# EAGLE schematic board2 (EAGLE 7.7.0)
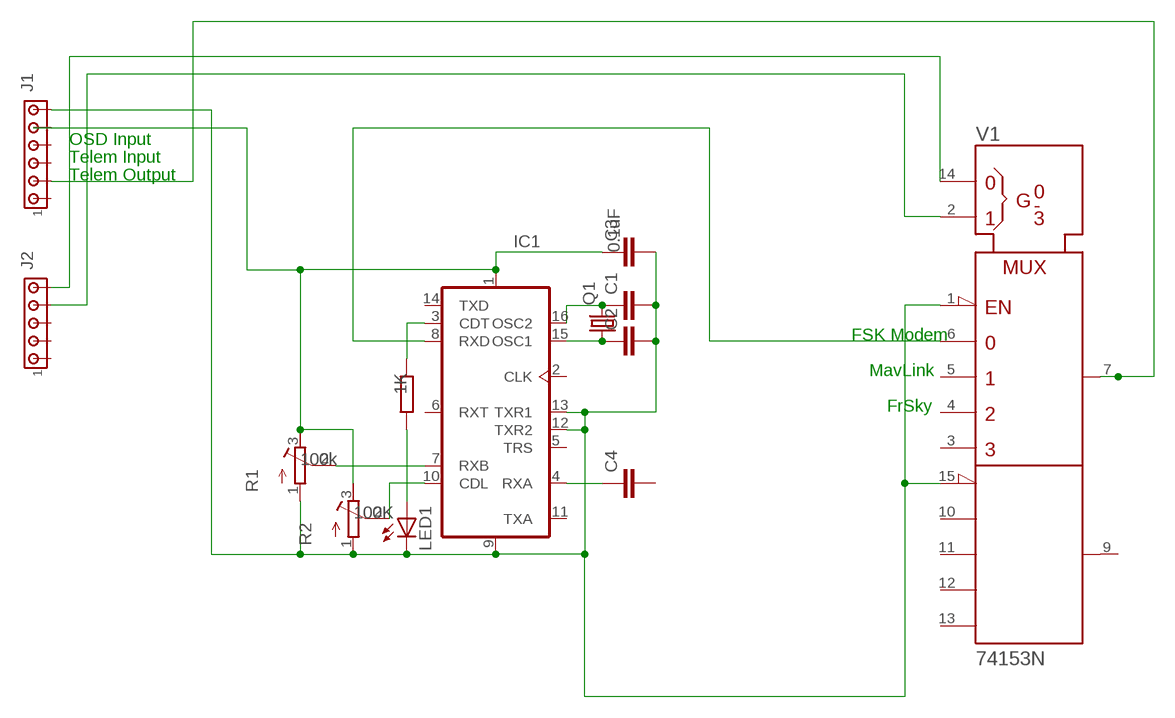
[diagram p0: schematic, sheet 1]
R3 (R): VAL: 1K

## Parts
C1  C2,5-3  [C2.5-3]
C2  C2,5-3  [C2.5-3]
C3  C2,5-3  [C2.5-3]
C4  C2,5-3  [C2.5-3]
IC1  TCM3105  [DIL16]
J1  MTA06-100  [10X06MTA]
J2  MTA05-156  [1X5MTA]
LED1  LED5MM  [LED5MM]
Q1  CRYSTALHC33U-V  [HC33U-V]
R1  R-TRIMM64W  [RTRIM64W]
R2  R-TRIMM64W  [RTRIM64W]
V1  74153N  [DIL16]

## Nets
N$1: C1.1 IC1.16(OSC2) Q1.2
N$2: C2.1 IC1.15(OSC1) Q1.1
N$3: IC1.10(CDL) R2.2(S)
N$4: IC1.3(CDT)
N$5: LED1.A
N$6: J1.2 V1.7(1Y)
N$7: IC1.7(RXB) R1.2(S)
N$9: C3.1 IC1.1(VDD) J1.5 R1.3(E) R2.3(E)
N$11: C4.1 IC1.4(RXA)
N$12: IC1.8(RXD) V1.6(1C0)
N$13: J2.5 V1.14(A)
N$14: J2.4 V1.2(B)
VSS: C1.2 C2.2 C3.2 IC1.9(VSS) IC1.12(TXR2) IC1.13(TXR1) J1.6 LED1.K(C) R1.1(A) R2.1(A) V1.1(!1G) V1.15(!2G)
Unconnected: C4.2 IC1.2(CLK) IC1.5(TRS) IC1.6(RXT) IC1.11(TXA) IC1.14(TXD) J1.1 J1.3 J1.4 J2.1 J2.2 J2.3 V1.3(1C3) V1.4(1C2) V1.5(1C1) V1.9(2Y) V1.10(2C0) V1.11(2C1) V1.12(2C2) V1.13(2C3)

## Notes on the sheet
- OSD Input
- Telem Input
- Telem Output
- FSK Modem
- MavLink
- FrSky

## Power pins joined to a net without a drawn wire
+UB: V1.16(+UB)
-UB: V1.8(-UB)

## Library data of the parts
C1 C2 C4 = capacitor-wima:C: CAPACITOR naming: grid - package width
C3 = capacitor-wima:C: CAPACITOR naming: grid - package width; VAL: 0.1uF
IC1 = tcm3105:TCM3105
J1 = con-amp:MTA06-100: AMP connector Connection corrected 2014-09-19
J2 = con-amp:MTA05-156: AMP connector
LED1 = led:LED: LED OSRAM: - CHIPLED LG R971, LG N971, LY N971, LG Q971, LY Q971, LO R971, LY R971 LH N974, LH R974 LS Q976, LO Q976, LY Q976 LO Q996 - Hyper CHIPLED LW Q18S LB Q993, LB Q99A, LB R99A - SideLED LS A670, LO A670, LY A670, LG A670, LP A670 LB A673, LV A673, LT A673, LW A673 LH A674 LY A675 LS A676, LA A676, LO A676, LY A676, LW A676 LS A679, LY A679, LG A679 - Hyper Micro SIDELED® LS Y876, LA Y876, LO Y876, LY Y876 LT Y87S - SmartLED LW L88C, LW L88S LB L89C, LB L89S, LG L890 LS L89K, LO L89K, LY L89K LS L896, LA L896, LO L896, LY L896 - TOPLED LS T670, LO T670, LY T670, LG T670, LP T670 LSG T670, LSP T670, LSY T670, LOP T670, LYG T670 LG T671, LOG T671, LSG T671 LB T673, LV T673, LT T673, LW T673 LH T674 LS T676, LA T676, LO T676, LY T676, LB T676, LH T676, LSB T676, LW T676 LB T67C, LV T67C, LT T67C, LS T67K, LO T67K, LY T67K, LW E67C LS E67B, LA E67B, LO E67B, LY E67B, LB E67C, LV E67C, LT E67C LW T67C LS T679, LY T679, LG T679 LS T770, LO T770, LY T770, LG T770, LP T770 LB T773, LV T773, LT T773, LW T773 LH T774 LS E675, LA E675, LY E675, LS T675 LS T776, LA T776, LO T776, LY T776, LB T776 LHGB T686 LT T68C, LB T68C - Hyper Mini TOPLED® LB M676 - Mini TOPLED Santana® LG M470 LS M47K, LO M47K, LY M47K Source: http://www.osram.convergy.de LUXEON: - LUMILED® LXK2-PW12-R00, LXK2-PW12-S00, LXK2-PW14-U00, LXK2-PW14-V00 LXK2-PM12-R00, LXK2-PM12-S00, LXK2-PM14-U00 LXK2-PE12-Q00, LXK2-PE12-R00, LXK2-PE12-S00, LXK2-PE14-T00, LXK2-PE14-U00 LXK2-PB12-K00, LXK2-PB12-L00, LXK2-PB12-M00, LXK2-PB14-N00, LXK2-PB14-P00, LXK2-PB14-Q00 LXK2-PR12-L00, LXK2-PR12-M00, LXK2-PR14-Q00, LXK2-PR14-R00 LXK2-PD12-Q00, LXK2-PD12-R00, LXK2-PD12-S00 LXK2-PH12-R00, LXK2-PH12-S00 LXK2-PL12-P00, LXK2-PL12-Q00, LXK2-PL12-R00 Source: www.luxeon.com KINGBRIGHT: KA-3528ASYC Source: www.kingbright.com
Q1 = crystal:CRYSTAL: CRYSTAL; OC_FARNELL: unknown; OC_NEWARK: unknown
R1 = rcl:R-TRIMM: Trimm resistor; VAL: 100k
R2 = rcl:R-TRIMM: Trimm resistor; VAL: 100K
V1 = 74ttl-din:74*153: Dual 4-line to 1-line data SELECTOR/MULTIPLEXER